# Altium schematic sheet an205x_evb.SchDoc
size A3
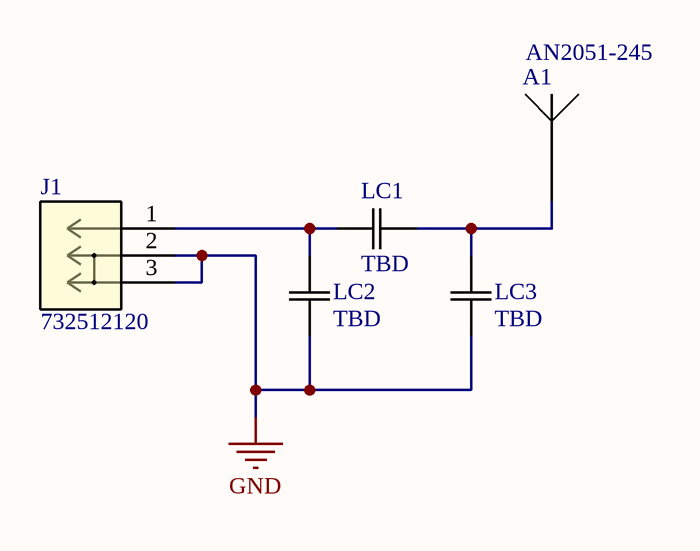
[diagram p0: an205x_evb.SchDoc]

## Parts
A1  AN2051-245  [ANT_AN2051-245_RSN]
J1  732512120  [CONN-732513152_MOL]
LC1  TBD  [CAP_CC0402_YAG]
LC2  TBD  [CAP_CC0402_YAG]
LC3  TBD  [CAP_CC0402_YAG]

## Nets
GND: J1.2 J1.3 LC2.1 LC3.1
NetA1_1: A1.1 LC1.2 LC3.2
NetJ1_1: J1.1 LC1.1 LC2.2

## Library data of the parts
A1 = AN2051-245: No Description Available; Mfr_Name: RainSun; Copyright: Copyright (C) 2022 Ultra Librarian. All rights reserved.; Manufacturer_Part_Number: AN2051-245
J1 = 732512120: No Description Available; Mfr_Name: Molex Connector Corporation; Copyright: Copyright (C) 2022 Ultra Librarian. All rights reserved.; Manufacturer_Part_Number: 732512120; RefDes: RefDes; Type: DEV
LC1-LC3 = CC0402MRX5R6BB106: Mfr_Name: Yageo; Copyright: Copyright (C) 2022 Ultra Librarian. All rights reserved.; Manufacturer_Part_Number: CC0402MRX5R6BB106; RefDes: RefDes; Type: DEV